# EAGLE design DigitalClock-7221 (EAGLE 7.5.0)
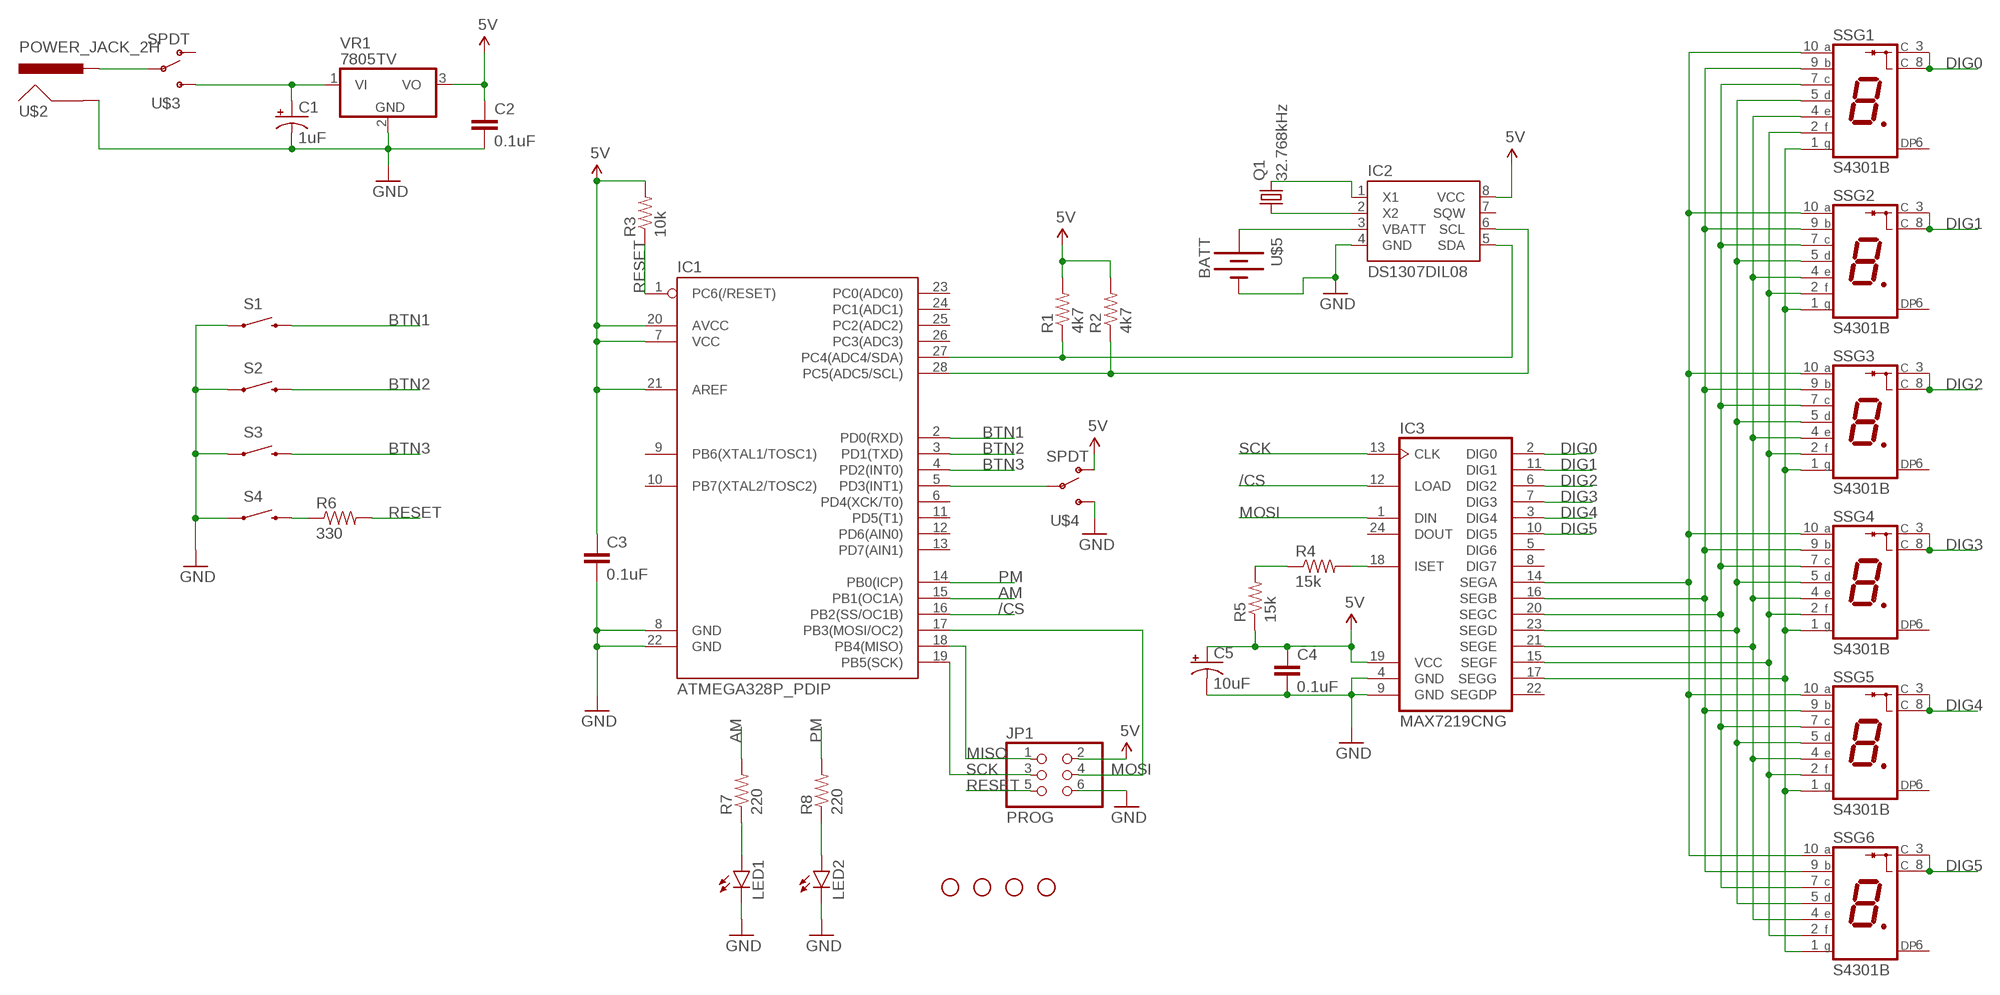
[diagram p0: schematic, sheet 1]

## Parts
C1  1uF  CAP_POLPTH2  [CPOL-RADIAL-10UF-25V]
C2  0.1uF  CAPPTH1  [CAP-PTH-5MM]
C3  0.1uF  CAPPTH1  [CAP-PTH-5MM]
C4  0.1uF  CAPPTH1  [CAP-PTH-5MM]
C5  10uF  CAP_POLPTH2  [CPOL-RADIAL-10UF-25V]
H1  STAND-OFF  [STAND-OFF]
H2  STAND-OFF  [STAND-OFF]
H3  STAND-OFF  [STAND-OFF]
H4  STAND-OFF  [STAND-OFF]
IC1  ATMEGA328P_PDIP  [DIL28-3]
IC2  DS1307DIL08  [DIL08]
IC3  MAX7219CNG  [DIL24-3]
JP1  PROG  PINHD-2X3  [2X03]
LED1  LED5MM  [LED5MM]
LED2  LED5MM  [LED5MM]
Q1  32.768kHz  CRYSTALTC26V  [TC26V]
R1  4k7  RESISTORAXIAL-0.3  [AXIAL-0.3]
R2  4k7  RESISTORAXIAL-0.3  [AXIAL-0.3]
R3  10k  RESISTORAXIAL-0.3  [AXIAL-0.3]
R4  15k  RESISTORAXIAL-0.3  [AXIAL-0.3]
R5  15k  RESISTORAXIAL-0.3  [AXIAL-0.3]
R6  330  RESISTORAXIAL-0.3  [AXIAL-0.3]
R7  220  RESISTORAXIAL-0.3  [AXIAL-0.3]
R8  220  RESISTORAXIAL-0.3  [AXIAL-0.3]
S1  SWITCH-MOMENTARY-2PTH  [TACTILE-PTH]
S2  SWITCH-MOMENTARY-2PTH  [TACTILE-PTH]
S3  SWITCH-MOMENTARY-2PTH  [TACTILE-PTH]
S4  SWITCH-MOMENTARY-2PTH  [TACTILE-PTH]
SSG1  S4301B  [S4301B]
SSG2  S4301B  [S4301B]
SSG3  S4301B  [S4301B]
SSG4  S4301B  [S4301B]
SSG5  S4301B  [S4301B]
SSG6  S4301B  [S4301B]
U$2  POWER_JACK_2H  [POWER_JACK_2H]
U$3  SPDT  [SPDT]
U$4  SPDT  [SPDT]
U$5  BATT  [BATT]
VR1  7805TV  [TO220V]

## Nets
5V: C2.1 C3.1 C4.1 C5.1(+) IC1.7(VCC) IC1.20(AVCC) IC1.21(AREF) IC2.8(VCC) IC3.19(VCC) JP1.2 R1.P$2 R2.P$2 R3.P$2 R5.P$1 U$4.P$2(O) VR1.3(VO)
/CS: IC1.16(PB2(SS/OC1B)) IC3.12(LOAD)
AM: IC1.15(PB1(OC1A)) R7.P$2
BTN1: IC1.2(PD0(RXD)) S1.3
BTN2: IC1.3(PD1(TXD)) S2.3
BTN3: IC1.4(PD2(INT0)) S3.3
DIG0: IC3.2(DIG0) SSG1.3(C) SSG1.8(C)
DIG1: IC3.11(DIG1) SSG2.3(C) SSG2.8(C)
DIG2: IC3.6(DIG2) SSG3.3(C) SSG3.8(C)
DIG3: IC3.7(DIG3) SSG4.3(C) SSG4.8(C)
DIG4: IC3.3(DIG4) SSG5.3(C) SSG5.8(C)
DIG5: IC3.10(DIG5) SSG6.3(C) SSG6.8(C)
GND: C1.2(-) C2.2 C3.2 C4.2 C5.2(-) IC1.8(GND) IC1.22(GND) IC2.4(GND) IC3.4(GND) IC3.9(GND) JP1.6 LED1.K(C) LED2.K(C) S1.1 S2.1 S3.1 S4.1 U$2.P$1(GND) U$4.P$3(S) U$5.P$2(-) VR1.2(GND)
MISO: IC1.18(PB4(MISO)) JP1.1
MOSI: IC1.17(PB3(MOSI/OC2)) IC3.1(DIN) JP1.4
N$1: U$2.P$2(PWR) U$3.P$1(P)
N$2: C1.1(+) U$3.P$3(S) VR1.1(VI)
N$3: IC2.2(X2) Q1.1
N$4: IC2.1(X1) Q1.2
N$5: IC1.5(PD3(INT1)) U$4.P$1(P)
N$6: R6.P$1 S4.3
N$7: LED2.A R8.P$1
N$8: LED1.A R7.P$1
N$9: IC3.18(ISET) R4.P$2
N$10: IC2.3(VBATT) U$5.P$1(+)
N$11: IC1.27(PC4(ADC4/SDA)) IC2.5(SDA) R1.P$1
N$12: IC1.28(PC5(ADC5/SCL)) IC2.6(SCL) R2.P$1
N$13: R4.P$1 R5.P$2
N$18: IC3.17(SEGG) SSG1.1(G) SSG2.1(G) SSG3.1(G) SSG4.1(G) SSG5.1(G) SSG6.1(G)
N$19: IC3.15(SEGF) SSG1.2(F) SSG2.2(F) SSG3.2(F) SSG4.2(F) SSG5.2(F) SSG6.2(F)
N$20: IC3.21(SEGE) SSG1.4(E) SSG2.4(E) SSG3.4(E) SSG4.4(E) SSG5.4(E) SSG6.4(E)
N$21: IC3.23(SEGD) SSG1.5(D) SSG2.5(D) SSG3.5(D) SSG4.5(D) SSG5.5(D) SSG6.5(D)
N$22: IC3.20(SEGC) SSG1.7(C) SSG2.7(C) SSG3.7(C) SSG4.7(C) SSG5.7(C) SSG6.7(C)
N$23: IC3.16(SEGB) SSG1.9(B) SSG2.9(B) SSG3.9(B) SSG4.9(B) SSG5.9(B) SSG6.9(B)
N$24: IC3.14(SEGA) SSG1.10(A) SSG2.10(A) SSG3.10(A) SSG4.10(A) SSG5.10(A) SSG6.10(A)
PM: IC1.14(PB0(ICP)) R8.P$2
RESET: IC1.1(PC6(/RESET)) JP1.5 R3.P$1 R6.P$2
SCK: IC1.19(PB5(SCK)) IC3.13(CLK) JP1.3
Unconnected: IC1.6(PD4(XCK/T0)) IC1.9(PB6(XTAL1/TOSC1)) IC1.10(PB7(XTAL2/TOSC2)) IC1.11(PD5(T1)) IC1.12(PD6(AIN0)) IC1.13(PD7(AIN1)) IC1.23(PC0(ADC0)) IC1.24(PC1(ADC1)) IC1.25(PC2(ADC2)) IC1.26(PC3(ADC3)) IC2.7(SQW) IC3.5(DIG6) IC3.8(DIG7) IC3.22(SEGDP) IC3.24(DOUT) SSG1.6(DP) SSG2.6(DP) SSG3.6(DP) SSG4.6(DP) SSG5.6(DP) SSG6.6(DP) U$3.P$2(O)

## Library data of the parts
C1 C5 = SparkFun-Capacitors:CAP_POL: Capacitor Polarized These are standard SMD and PTH capacitors. Normally 10uF, 47uF, and 100uF in electrolytic and tantalum varieties. Always verify the external diameter of the through hole cap, it varies with capacity, voltage, and manufacturer. The EIA devices should be standard.
C2-C4 = SparkFun-Capacitors:CAP: Capacitor Standard 0603 ceramic capacitor, and 0.1" leaded capacitor.
H1-H4 = SparkFun-Electromechanical:STAND-OFF: #4 Stand Off This is the mechanical footprint for a #4 phillips button head screw. Use the keepout ring to avoid running the screw head into surrounding components. SKU : PRT-00447
IC1 = SparkFun-DigitalIC:ATMEGA328P_PDIP: uC used in the Arduino 32kb flash, 1k EEPROM, 2k SRAM This is the through-hole version of this chip.
IC2 = custom:DS1307: I2C real-time clock with battery backup.
IC3 = maxim:MAX7219CNG: LED DISPLAY DRIVER; MF: MAXIM; MPN: MAX7219CNG; OC_FARNELL: 1523914; OC_NEWARK: 34C4018
JP1 = pinhead:PINHD-2X3: PIN HEADER
LED1 LED2 = SparkFun-LED:LED: LEDs Standard schematic elements and footprints for 5mm, 3mm, 1206, and 0603 sized LEDs. 5mm - Spark Fun Electronics SKU : COM-00529 (and others)
Q1 = crystal:CRYSTAL: CRYSTAL; OC_FARNELL: unknown; OC_NEWARK: unknown
R1-R8 = SparkFun-Resistors:RESISTOR: Resistor Basic schematic elements and footprints for 0603, 1206, and PTH resistors.
S1-S4 = SparkFun-Electromechanical:SWITCH-MOMENTARY-2: Various NO switches- pushbuttons, reed, etc; PROD_ID: SWCH-08441
SSG1-SSG6 = led-7-segment:S4301B: Single Digit Seven-Segment Display (cathode common) Source: LITEON .. S4301B.pdf; OC_FARNELL: unknown; OC_NEWARK: unknown
U$2 = custom:POWER_JACK_2H
U$3 U$4 = custom:SPDT
U$5 = custom:BATT
VR1 = linear:78*: Positive VOLTAGE REGULATOR Source: http://cache.national.com/ds/LM/LM78L05.pdf http://www.fairchildsemi.com/ds/LM/LM7805.pdf

## Board
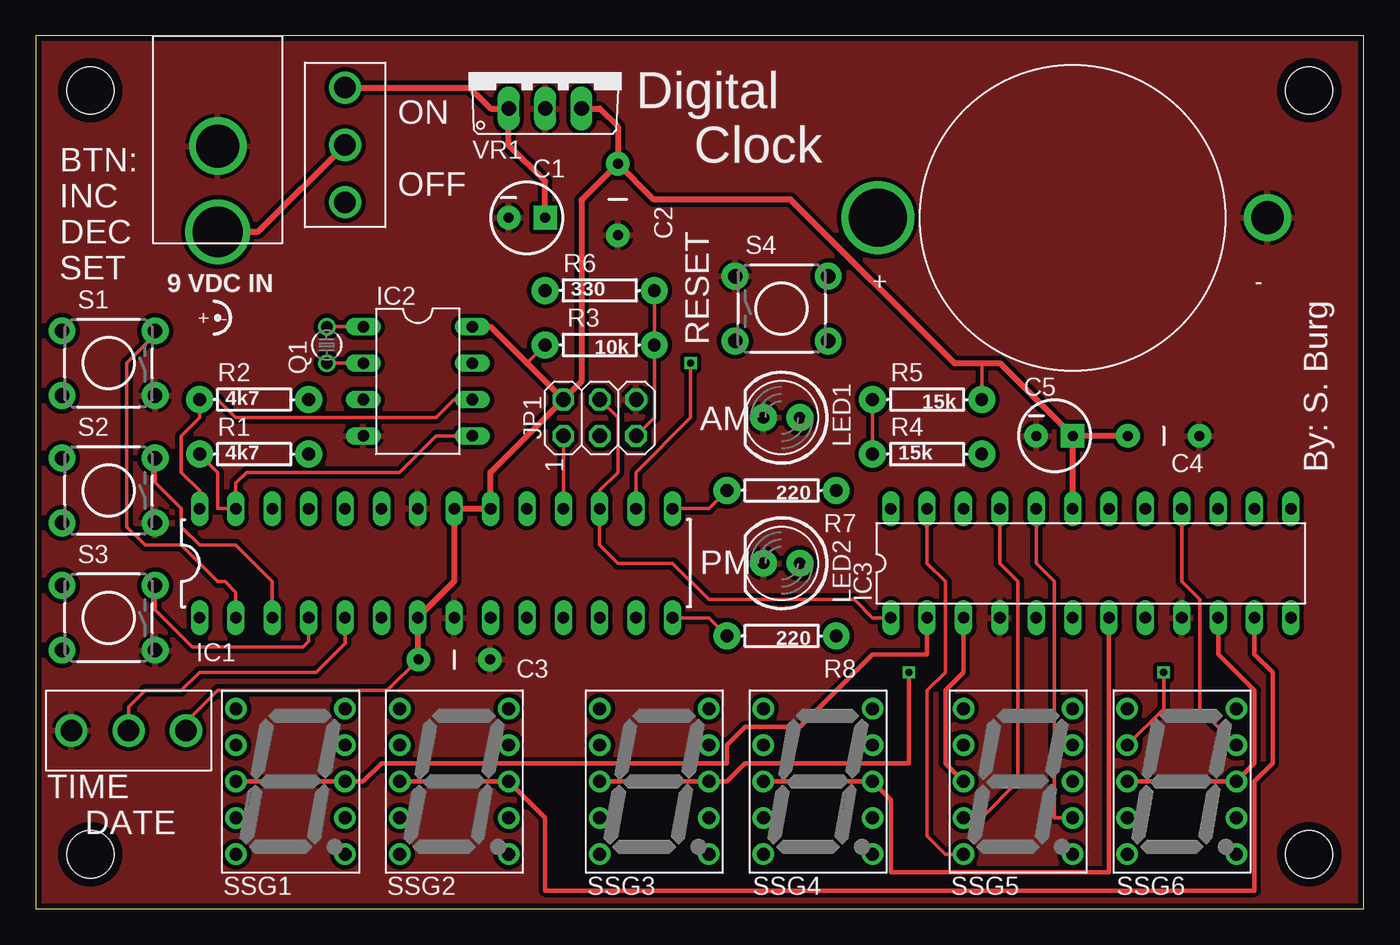
[diagram p1: board, top side]
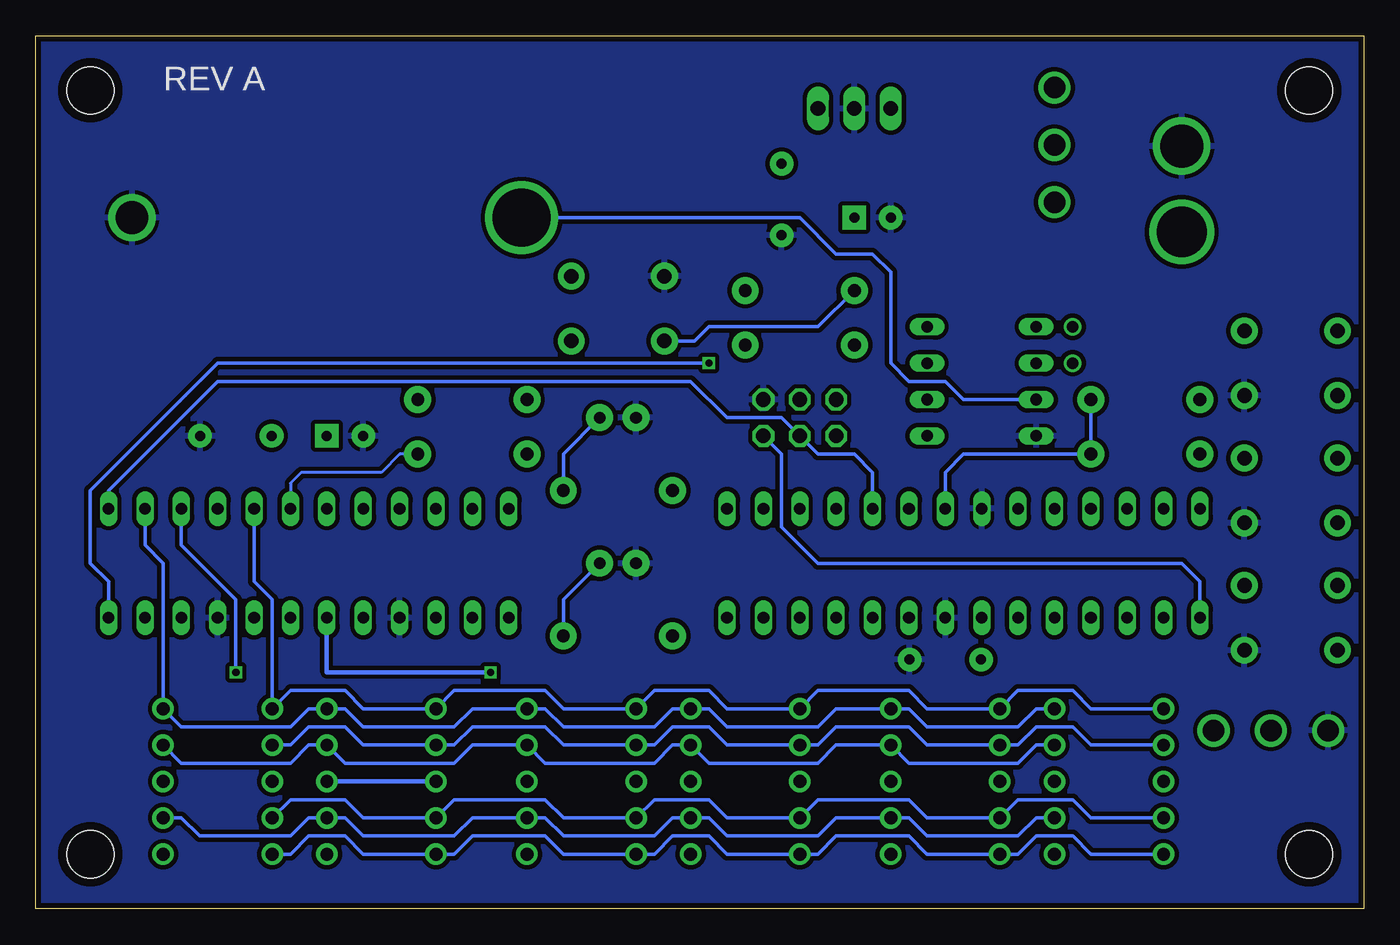
[diagram p2: board, bottom side, seen from below]

Size 92.71 x 60.96 mm. Coordinates in mm from the lower left corner, seen from the top.
Outline: 0,0 92.71,0 92.71,60.96 0,60.96 0,0
Copper layers (1*16): Top 0.0356mm / dielectric 1.5011mm / Bottom 0.0356mm
Design rules "oshpark-2layer *": minimum track width 6mil, minimum drill 13mil, track to track 6mil, track to pad 6mil, pad to pad 6mil, via to via 6mil, smd to smd 6mil, copper to edge 15mil, drill to drill 6mil, minimum pad ring 7mil, minimum via ring 7mil, stop-mask expansion 2.5mil, vias tented up to drill 20mil, thermal gap 10mil

### Footprints (pad centres in the part's own frame; a part is rotated, then mirrored left to right if it is on the bottom)
CPOL-RADIAL-10UF-25V = drill 0.7 pad 1.651 square: 1 1.27,0 | drill 0.7 pad 1.651: 2 -1.27,0
CAP-PTH-5MM = drill 0.7 pad 1.651: 1 -2.5,0; 2 2.5,0
STAND-OFF = hole 3.302: 0,0
DIL28-3 = drill 0.813 long: 1 -16.51,-3.81; 2 -13.97,-3.81; 3 -11.43,-3.81; 4 -8.89,-3.81; 5 -6.35,-3.81; 6 -3.81,-3.81; 7 -1.27,-3.81; 8 1.27,-3.81; 9 3.81,-3.81; 10 6.35,-3.81; 11 8.89,-3.81; 12 11.43,-3.81; 13 13.97,-3.81; 14 16.51,-3.81; 15 16.51,3.81; 16 13.97,3.81; 17 11.43,3.81; 18 8.89,3.81; 19 6.35,3.81; 20 3.81,3.81; 21 1.27,3.81; 22 -1.27,3.81; 23 -3.81,3.81; 24 -6.35,3.81; 25 -8.89,3.81; 26 -11.43,3.81; 27 -13.97,3.81; 28 -16.51,3.81
DIL08 = drill 0.813 long: 1 -3.81,-3.81; 2 -1.27,-3.81; 3 1.27,-3.81; 4 3.81,-3.81; 5 3.81,3.81; 6 1.27,3.81; 7 -1.27,3.81; 8 -3.81,3.81
DIL24-3 = drill 0.813 long: 1 -13.97,-3.81; 2 -11.43,-3.81; 3 -8.89,-3.81; 4 -6.35,-3.81; 5 -3.81,-3.81; 6 -1.27,-3.81; 7 1.27,-3.81; 8 3.81,-3.81; 9 6.35,-3.81; 10 8.89,-3.81; 11 11.43,-3.81; 12 13.97,-3.81; 13 13.97,3.81; 14 11.43,3.81; 15 8.89,3.81; 16 6.35,3.81; 17 3.81,3.81; 18 1.27,3.81; 19 -1.27,3.81; 20 -3.81,3.81; 21 -6.35,3.81; 22 -8.89,3.81; 23 -11.43,3.81; 24 -13.97,3.81
2X03 = drill 1.016 octagon: 1 -2.54,-1.27; 2 -2.54,1.27; 3 0,-1.27; 4 0,1.27; 5 2.54,-1.27; 6 2.54,1.27
LED5MM = drill 0.813 pad 1.88: A -1.27,0; K 1.27,0
TC26V = drill 0.813: 1 -1.27,0; 2 1.27,0
AXIAL-0.3 = drill 0.9 pad 1.88: P$1 -3.81,0; P$2 3.81,0
TACTILE-PTH = drill 1.016 pad 1.88: 1 -3.251,2.261; 2 3.251,2.261; 3 -3.251,-2.261; 4 3.251,-2.261
S4301B = drill 0.9 pad 1.5: 1 -3.81,5.08; 2 -3.81,2.54; 3 -3.81,0; 4 -3.81,-2.54; 5 -3.81,-5.08; 6 3.81,-5.08; 7 3.81,-2.54; 8 3.81,0; 9 3.81,2.54; 10 3.81,5.08
POWER_JACK_2H = drill 3: P$1 7.696,0 | drill 3.5: P$2 13.691,0
SPDT = drill 1.5: P$1 0,0; P$2 -4,0; P$3 4,0
BATT = drill 4.064: P$1 -13.6,0 | drill 2.286: P$2 13.6,0
TO220V = drill 1.016 long: 1 -2.54,-2.54; 2 0,-2.54; 3 2.54,-2.54

### Placement (x,y rotation side)
C1  34.29,48.26 0 top
C2  40.64,49.53 270 top
C3  29.21,17.4 0 top
C4  78.74,33.02 0 top
C5  71.12,33.02 0 top
H1  3.81,3.81 0 top
H2  88.9,3.81 0 top
H3  3.81,57.15 0 top
H4  88.9,57.15 0 top
IC1  27.94,24.13 0 top
IC2  26.67,36.83 270 top
IC3  73.66,24.13 0 top
JP1  39.37,34.29 0 top
LED1  52.07,34.29 180 top
LED2  52.07,24.13 180 top
Q1  20.32,39.37 90 top
R1  15.24,31.75 0 top
R2  15.24,35.56 0 top
R3  39.37,39.37 180 top
R4  62.23,31.75 0 top
R5  62.23,35.56 180 top
R6  39.37,43.18 0 top
R7  52.07,29.21 180 top
R8  52.07,19.05 180 top
S1  5.08,38.1 180 top
S2  5.08,29.21 180 top
S3  5.08,20.32 180 top
S4  52.07,41.91 0 top
SSG1  17.78,8.89 0 top
SSG2  29.21,8.89 0 top
SSG3  43.18,8.89 0 top
SSG4  54.61,8.89 0 top
SSG5  68.58,8.89 0 top
SSG6  80.01,8.89 0 top
U$2  12.7,60.96 270 top
U$3  21.59,53.34 90 top
U$4  6.48,12.45 180 top
U$5  72.39,48.26 0 top
VR1  35.56,58.42 0 top

### Tracks (layer width: path | path; a pad name or v marks a point on that pad's centre or on a via)
5V
  Top 0.254: R5.P$1 66.04,38.1 | R3.P$2 34.29,38.1 | U$4.P$2 10.48,13.02 12.7,15.24 24.51,15.24 C3.1
  Top 0.406: C5.1 67.31,38.1 66.04,38.1 64.14,38.1 52.7,49.53 43.14,49.53 C2.1 | IC3.19 C5.1 | C4.1 C5.1 | IC2.8 31.75,40.64 34.29,38.1 JP1.2 | JP1.2 31.75,30.48 IC1.20 IC1.21 29.21,22.86 IC1.7 C3.1 | JP1.2 38.1,36.83 38.1,49.49 C2.1 | VR1.3 39.37,55.88 40.64,54.61 C2.1
  Bottom 0.254: R2.P$2 R1.P$2 27.94,31.75 29.21,30.48 IC1.21
/CS  (via drill 0.5)
  Top 0.254: v45.72,38.1 45.72,34.29 41.91,30.48 IC1.16
  Bottom 0.254: IC3.12 87.63,22.86 88.9,24.13 88.9,29.21 80.01,38.1 v45.72,38.1
AM
  Top 0.254: IC1.15 46.99,27.94 R7.P$2
BTN1
  Top 0.254: S1.3 8.33,40.08 6.35,38.1 6.35,26.67 7.62,25.4 10.16,25.4 12.7,22.86 13.21,22.86 13.97,22.1 IC1.2
BTN2
  Top 0.254: S2.3 8.33,29.77 10.16,27.94 10.16,26.67 11.43,25.4 13.97,25.4 16.51,22.86 IC1.3
BTN3
  Top 0.254: S3.3 8.33,20.88 10.92,18.29 18.67,18.29 19.05,18.67 IC1.4
DIG0
  Top 0.305: SSG1.3 SSG1.8 22.86,8.89 24.13,10.16 48.26,10.16 48.26,11.43 49.53,12.7 53.34,12.7 58.42,17.78 62.23,17.78 IC3.2
DIG1
  Top 0.305: SSG2.3 SSG2.8 35.56,6.35 35.56,1.27 85.09,1.27 85.09,8.89 86.36,10.16 86.36,16.51 85.09,17.78 IC3.11
DIG2  (via drill 0.5)
  Top 0.305: SSG3.3 SSG3.8 48.26,8.89 49.53,10.16 60.96,10.16 v60.96,16.51
  Bottom 0.305: v60.96,16.51 72.39,16.51 IC3.6
DIG3
  Top 0.305: SSG4.3 SSG4.8 59.69,7.62 59.69,2.54 74.93,2.54 IC3.7
DIG4
  Top 0.305: SSG5.3 63.5,10.16 63.5,15.24 64.77,16.51 IC3.3
  Bottom 0.305: SSG5.8 SSG5.3
DIG5
  Top 0.305: SSG6.3 SSG6.8 85.09,10.16 85.09,15.24 82.55,17.78 IC3.10
GND
  pour Top (isolate 0.305): 0,0 92.71,0 92.71,60.96 0,60.96
  pour Bottom (isolate 0.305): 0,0 92.71,0 92.71,60.96 0,60.96
MISO
  Top 0.254: JP1.1 IC1.18
MOSI
  Top 0.254: IC3.1 58.42,20.32 57.15,21.59 46.99,21.59 44.45,24.13 40.64,24.13 39.37,25.4 IC1.17 39.37,29.21 40.64,30.48 40.64,34.29 JP1.4
N$1
  Top 0.406: U$2.P$2 15.52,47.27 U$3.P$1
N$2
  Top 0.406: U$3.P$3 30.29,57.34 31.75,55.88 VR1.1 33.02,53.34 35.56,50.8 C1.1
N$3
  Top 0.254: Q1.1 IC2.2
N$4
  Top 0.254: Q1.2 IC2.1
N$5
  Top 0.254: U$4.P$1 6.48,14.1 7.62,15.24 10.16,15.24 11.43,16.51 19.56,16.51 21.59,18.54 IC1.5
N$6
  Bottom 0.254: S4.3 46.71,39.65 45.72,40.64 38.1,40.64 R6.P$1
N$7
  Bottom 0.254: R8.P$1 55.88,21.59 LED2.A
N$8
  Bottom 0.254: R7.P$1 55.88,31.75 LED1.A
N$9
  Bottom 0.203: R4.P$2 67.31,31.75 68.58,30.48 74.17,30.48 74.93,29.72 IC3.18
N$10
  Bottom 0.254: U$5.P$1 39.37,48.26 36.83,45.72 34.29,45.72 33.02,44.45 33.02,38.1 31.75,36.83 29.21,36.83 27.94,35.56 IC2.3
N$11
  Top 0.254: IC2.5 27.94,33.02 25.4,30.48 14.73,30.48 13.97,29.72 IC1.27 12.7,27.94 12.7,30.48 R1.P$1
N$12
  Top 0.254: IC2.6 29.21,35.56 27.94,34.29 13.97,34.29 12.7,35.56 R2.P$1 11.43,34.29 10.16,33.02 10.16,30.48 11.43,29.21 IC1.28
N$13
  Top 0.254: R5.P$2 R4.P$1
N$18
  Bottom 0.254: SSG1.1 19.05,13.97 20.32,15.24 24.13,15.24 SSG2.1 30.48,13.97 31.75,15.24 38.1,15.24 SSG3.1 44.45,13.97 45.72,15.24 49.53,15.24 SSG4.1 55.88,13.97 57.15,15.24 63.5,15.24 SSG5.1 69.85,13.97 71.12,15.24 74.93,15.24 SSG6.1 76.2,21.59 77.47,22.86 IC3.17
N$19  (via drill 0.5)
  Top 0.254: v78.74,16.51 78.74,13.97 SSG6.2
  Bottom 0.254: SSG1.2 19.05,11.43 20.32,12.7 22.86,12.7 24.13,11.43 SSG2.2 30.48,11.43 31.75,12.7 36.83,12.7 38.1,11.43 SSG3.2 44.45,11.43 45.72,12.7 48.26,12.7 49.53,11.43 SSG4.2 55.88,11.43 57.15,12.7 62.23,12.7 63.5,11.43 SSG5.2 69.85,11.43 71.12,12.7 73.66,12.7 74.93,11.43 SSG6.2 | IC3.15 82.55,25.4 78.74,21.59 v78.74,16.51
N$20
  Top 0.254: IC3.21 67.31,24.13 68.58,22.86 68.58,8.89 66.04,6.35 SSG5.4
  Bottom 0.254: SSG1.4 19.05,6.35 20.32,7.62 24.13,7.62 SSG2.4 30.48,6.35 31.75,7.62 38.1,7.62 SSG3.4 44.45,6.35 45.72,7.62 49.53,7.62 SSG4.4 55.88,6.35 57.15,7.62 63.5,7.62 SSG5.4 69.85,6.35 71.12,7.62 74.93,7.62 SSG6.4
N$21
  Top 0.254: IC3.23 62.23,24.13 63.5,22.86 63.5,16.51 62.23,15.24 62.23,5.08 63.5,3.81 SSG5.5
  Bottom 0.254: SSG1.5 19.05,3.81 20.32,5.08 22.86,5.08 24.13,3.81 SSG2.5 30.48,3.81 31.75,5.08 36.83,5.08 38.1,3.81 SSG3.5 44.45,3.81 45.72,5.08 48.26,5.08 49.53,3.81 SSG4.5 55.88,3.81 57.15,5.08 62.23,5.08 63.5,3.81 SSG5.5 69.85,3.81 71.12,5.08 73.66,5.08 74.93,3.81 SSG6.5
N$22
  Top 0.254: IC3.20 69.85,24.13 71.12,22.86 71.12,6.35 SSG5.7
  Bottom 0.254: SSG1.7 22.86,6.35 24.13,5.08 30.48,5.08 31.75,6.35 SSG2.7 36.83,6.35 38.1,5.08 44.45,5.08 45.72,6.35 SSG3.7 48.26,6.35 49.53,5.08 55.88,5.08 57.15,6.35 SSG4.7 62.23,6.35 63.5,5.08 69.85,5.08 71.12,6.35 SSG5.7 73.66,6.35 74.93,5.08 81.28,5.08 82.55,6.35 SSG6.7
N$23
  Top 0.254: IC3.16 80.01,22.86 81.28,21.59 81.28,13.97 SSG6.9
  Bottom 0.254: SSG1.9 22.86,11.43 24.13,10.16 31.75,10.16 SSG2.9 36.83,11.43 38.1,10.16 45.72,10.16 SSG3.9 48.26,11.43 49.53,10.16 57.15,10.16 SSG4.9 62.23,11.43 63.5,10.16 71.12,10.16 SSG5.9 73.66,11.43 74.93,10.16 82.55,10.16 SSG6.9
N$24
  Bottom 0.254: SSG1.10 22.86,13.97 24.13,12.7 30.48,12.7 31.75,13.97 SSG2.10 36.83,13.97 38.1,12.7 44.45,12.7 45.72,13.97 SSG3.10 48.26,13.97 49.53,12.7 55.88,12.7 57.15,13.97 SSG4.10 62.23,13.97 63.5,12.7 69.85,12.7 71.12,13.97 SSG5.10 73.66,13.97 74.93,12.7 82.55,12.7 SSG6.10 83.82,24.13 85.09,25.4 IC3.14
PM
  Top 0.254: IC1.14 46.99,20.32 R8.P$2
RESET
  Top 0.254: R6.P$2 R3.P$1 43.18,34.29 JP1.5
  Bottom 0.254: IC1.1 11.43,22.86 12.7,24.13 38.1,24.13 40.64,26.67 40.64,31.75 JP1.5
SCK
  Bottom 0.254: IC3.13 87.63,29.21 80.01,36.83 46.99,36.83 44.45,34.29 40.64,34.29 JP1.3 38.1,31.75 35.56,31.75 34.29,30.48 IC1.19

### Text on the board
tPlace: Digital / Clock | ON / / OFF | BTN: / INC / DEC / SET | 9 VDC IN | + | - | + - | RESET | 1 | By: S. Burg | AM / / / / PM | TIME / DATE
bPlace: REV A